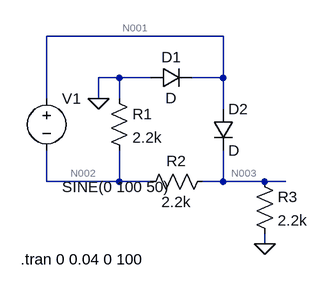
[diagram p0: schematic Draft1.asc]
Draft1.asc, the LTspice schematic file:
Version 4.1
SHEET 1 880 680
WIRE 320 16 48 16
WIRE 160 80 128 80
WIRE 208 80 160 80
WIRE 320 80 320 16
WIRE 320 80 272 80
WIRE 48 112 48 16
WIRE 128 112 128 80
WIRE 160 112 160 80
WIRE 320 128 320 80
WIRE 48 240 48 192
WIRE 160 240 160 192
WIRE 160 240 48 240
WIRE 208 240 160 240
WIRE 320 240 320 192
WIRE 320 240 288 240
WIRE 384 240 320 240
WIRE 416 240 384 240
WIRE 384 336 384 320
FLAG 128 112 0
FLAG 384 336 0
SYMBOL voltage 48 96 R0
WINDOW 3 24 152 Left 2
WINDOW 123 24 124 Left 2
WINDOW 39 0 0 Left 0
SYMATTR InstName V1
SYMATTR Value SINE(0 100 50)
SYMBOL res 144 96 R0
SYMATTR InstName R1
SYMATTR Value 2.2k
SYMBOL res 304 224 R90
WINDOW 0 0 56 VBottom 2
WINDOW 3 32 56 VTop 2
SYMATTR InstName R2
SYMATTR Value 2.2k
SYMBOL diode 208 96 R270
WINDOW 0 32 32 VTop 2
WINDOW 3 0 32 VBottom 2
SYMATTR InstName D1
SYMBOL diode 304 128 R0
SYMATTR InstName D2
SYMBOL res 368 224 R0
SYMATTR InstName R3
SYMATTR Value 2.2k
TEXT 8 360 Left 2 !.tran 0 0.04 0 100

The netlist it stands for:
* Draft1.asc
V1 N001 N002 SINE(0 100 50)
R1 0 N002 2.2k
R2 N003 N002 2.2k
D1 0 N001 D
D2 N001 N003 D
R3 N003 0 2.2k
.model D D
.lib standard.dio
.tran 0 0.04 0 100
.backanno
.end

* Results of the author's LTspice run, read from the files saved beside the schematic
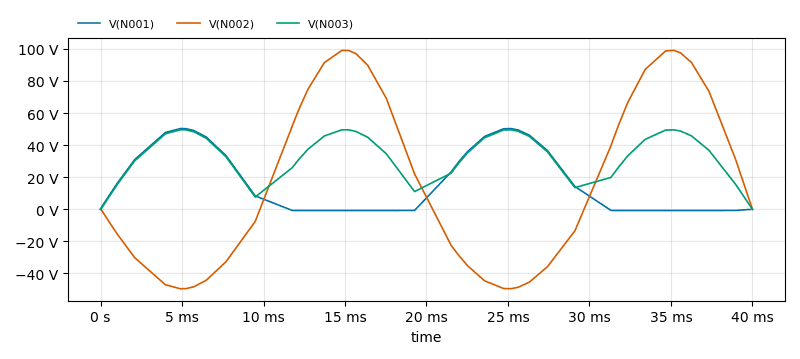
[diagram p1: Transient Analysis of Draft1.asc, plotted from the saved traces]
* Transient Analysis, 1 run:
*   V(N001): min -764.1 mV, max 50.36 V, average 16.17 V, rms 25.52 V, last 0 V
*   V(N002): min -49.6 V, max 99.08 V, average 16.23 V, rms 56.14 V, last 0 V
*   V(N003): min 0 V, max 49.6 V, average 32.34 V, rms 35.46 V, last 0 V